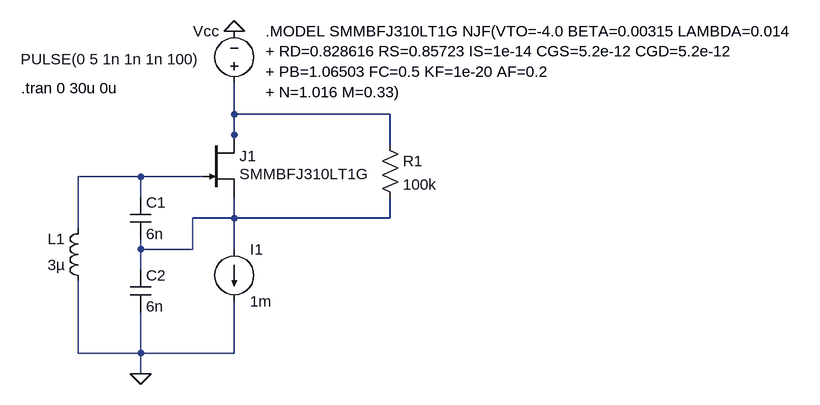
[diagram p0: schematic Colpitts with parasitics(Resr).asc]
Colpitts with parasitics(Resr).asc, the LTspice schematic file:
Version 4
SHEET 1 1568 680
WIRE 272 16 272 -32
WIRE 512 16 272 16
WIRE 272 48 272 16
WIRE 272 64 272 48
WIRE 512 64 512 16
WIRE 128 112 32 112
WIRE 224 112 128 112
WIRE 128 144 128 112
WIRE 272 176 272 144
WIRE 272 176 208 176
WIRE 512 176 512 144
WIRE 512 176 272 176
WIRE 32 192 32 112
WIRE 128 224 128 208
WIRE 208 224 208 176
WIRE 208 224 128 224
WIRE 272 224 272 176
WIRE 128 256 128 224
WIRE 32 384 32 272
WIRE 128 384 128 320
WIRE 128 384 32 384
WIRE 272 384 272 304
WIRE 272 384 128 384
WIRE 128 416 128 384
FLAG 272 -112 0
FLAG 128 416 0
SYMBOL njf 224 48 R0
WINDOW 3 56 60 Left 2
SYMATTR Value SMMBFJ310LT1G
SYMATTR InstName J1
SYMBOL voltage 272 -16 R180
WINDOW 0 24 96 Left 2
WINDOW 3 52 53 Left 2
WINDOW 123 0 0 Left 0
WINDOW 39 0 0 Left 0
SYMATTR InstName Vcc
SYMATTR Value PULSE(0 5 1n 1n 1n 100)
SYMBOL ind 48 288 R180
WINDOW 0 36 80 Left 2
WINDOW 3 36 40 Left 2
SYMATTR InstName L1
SYMATTR Value 3µ
SYMATTR SpiceLine Rser=2.6 Cpar=100pF
SYMBOL cap 112 144 R0
SYMATTR InstName C1
SYMATTR Value 6n
SYMBOL cap 112 256 R0
SYMATTR InstName C2
SYMATTR Value 6n
SYMBOL current 272 224 R0
WINDOW 123 0 0 Left 0
WINDOW 39 0 0 Left 0
SYMATTR InstName I1
SYMATTR Value 1m
SYMBOL res 496 48 R0
SYMATTR InstName R1
SYMATTR Value 100k
TEXT -56 -24 Left 2 !.tran 0 30u 0u
TEXT 320 -112 Left 2 !.MODEL SMMBFJ310LT1G NJF(VTO=-4.0 BETA=0.00315 LAMBDA=0.014 \n+ RD=0.828616 RS=0.85723 IS=1e-14 CGS=5.2e-12 CGD=5.2e-12\n+ PB=1.06503 FC=0.5 KF=1e-20 AF=0.2\n+ N=1.016 M=0.33)

The netlist it stands for:
* Colpitts with parasitics(Resr).asc
J1 N001 N002 N003 SMMBFJ310LT1G
Vcc N001 0 PULSE(0 5 1n 1n 1n 100)
L1 0 N002 3µ Rser=2.6 Cpar=100pF
C1 N002 N003 6n
C2 N003 0 6n
I1 N003 0 1m
R1 N001 N003 100k
.model NJF NJF
.model PJF PJF
.lib standard.jft
.tran 0 30u 0u
.MODEL SMMBFJ310LT1G NJF(VTO=-4.0 BETA=0.00315 LAMBDA=0.014
+ RD=0.828616 RS=0.85723 IS=1e-14 CGS=5.2e-12 CGD=5.2e-12
+ PB=1.06503 FC=0.5 KF=1e-20 AF=0.2
+ N=1.016 M=0.33)
.backanno
.end